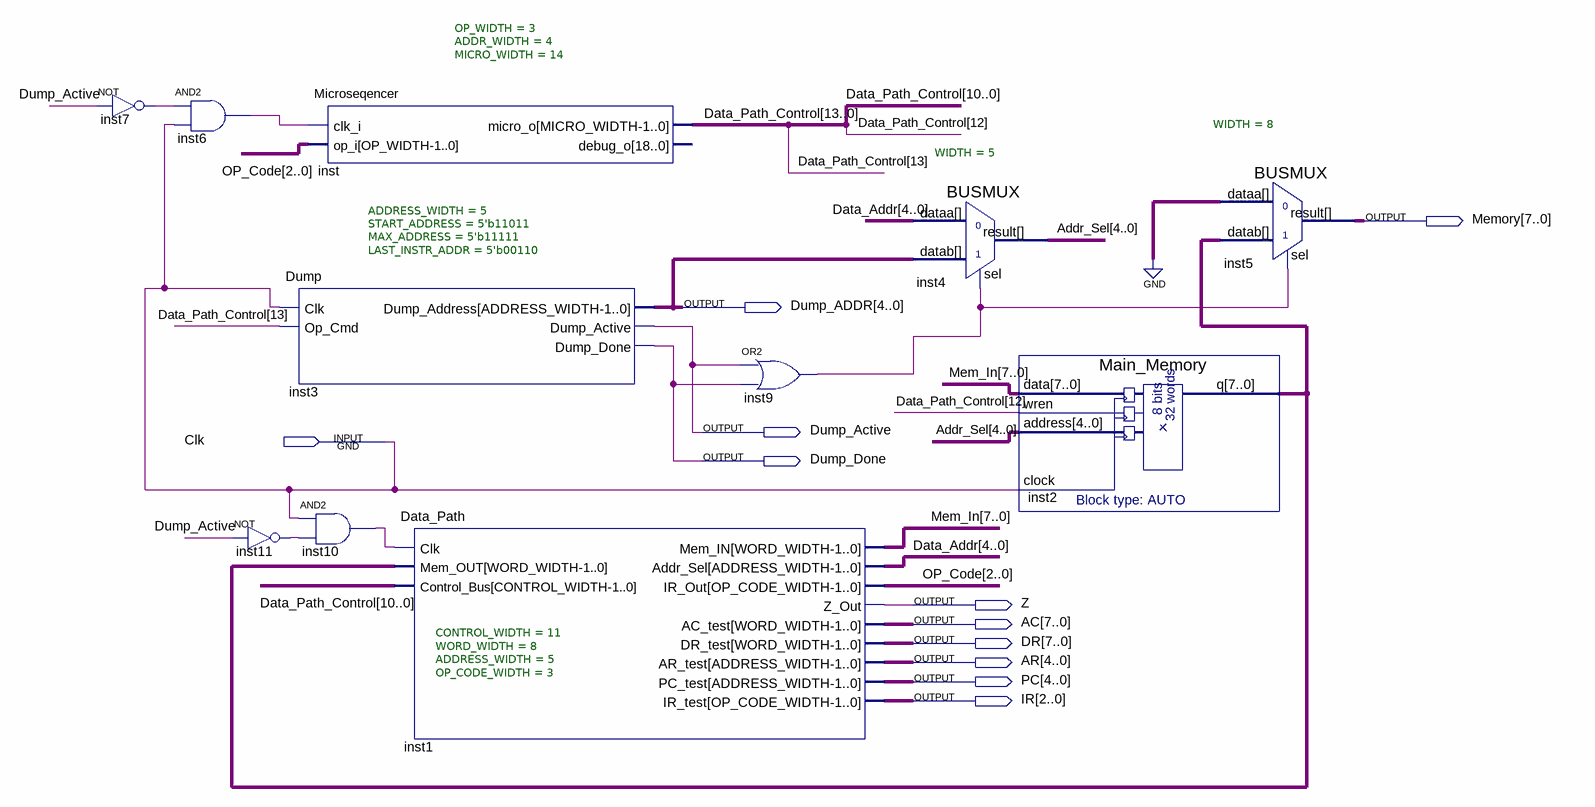
[diagram p0: schematic sheet]
// Quartus schematic commodore_67_full.bdf as structural Verilog: 11 symbols, 11 pins
module commodore_67_full (
  input  Clk,
  output [7:0] Memory,
  output [4:0] Dump_ADDR,
  output Dump_Active,
  output Dump_Done,
  output Z,
  output [7:0] AC,
  output [7:0] DR,
  output [4:0] AR,
  output [4:0] PC,
  output [2:0] IR
);

  wire inst6_out, inst7_out, inst9_out, inst10_out, inst11_out;
  wire [2:0] OP_Code;
  wire [4:0] Addr_Sel, Data_Addr;
  wire [7:0] inst2_q, Mem_In;
  wire [13:0] Data_Path_Control;

  not inst7 (inst7_out, Dump_Active);
  and inst6 (inst6_out, inst7_out, Clk);
  Dump #(.ADDRESS_WIDTH(5), .START_ADDRESS(5'b11011), .MAX_ADDRESS(5'b11111), .LAST_INSTR_ADDR(5'b00110)) inst3 (
    .Clk(Clk), .Op_Cmd(Data_Path_Control[13]), .Dump_Address(Dump_ADDR), .Dump_Active(Dump_Active),
    .Dump_Done(Dump_Done));
  and inst10 (inst10_out, Clk, inst11_out);
  not inst11 (inst11_out, Dump_Active);
  Microseqencer #(.OP_WIDTH(3), .ADDR_WIDTH(4), .MICRO_WIDTH(14)) inst (
    .clk_i(inst6_out), .op_i(OP_Code), .micro_o(Data_Path_Control));  // open: debug_o
  Data_Path #(.CONTROL_WIDTH(11), .WORD_WIDTH(8), .ADDRESS_WIDTH(5), .OP_CODE_WIDTH(3)) inst1 (
    .Clk(inst10_out), .Mem_OUT(inst2_q), .Control_Bus(Data_Path_Control[10:0]), .Mem_IN(Mem_In),
    .Addr_Sel(Data_Addr), .IR_Out(OP_Code), .Z_Out(Z), .AC_test(AC), .DR_test(DR), .AR_test(AR),
    .PC_test(PC), .IR_test(IR));
  or inst9 (inst9_out, Dump_Active, Dump_Done);
  BUSMUX #(.WIDTH(5)) inst4 (.datab(Dump_ADDR), .sel(inst9_out), .dataa(Data_Addr), .result(Addr_Sel));
  Main_Memory inst2 (.data(Mem_In), .wren(Data_Path_Control[12]), .address(Addr_Sel), .clock(Clk), .q(inst2_q));
  BUSMUX #(.WIDTH(8)) inst5 (.datab(inst2_q), .sel(inst9_out), .dataa({8{1'b0}}), .result(Memory));
endmodule
